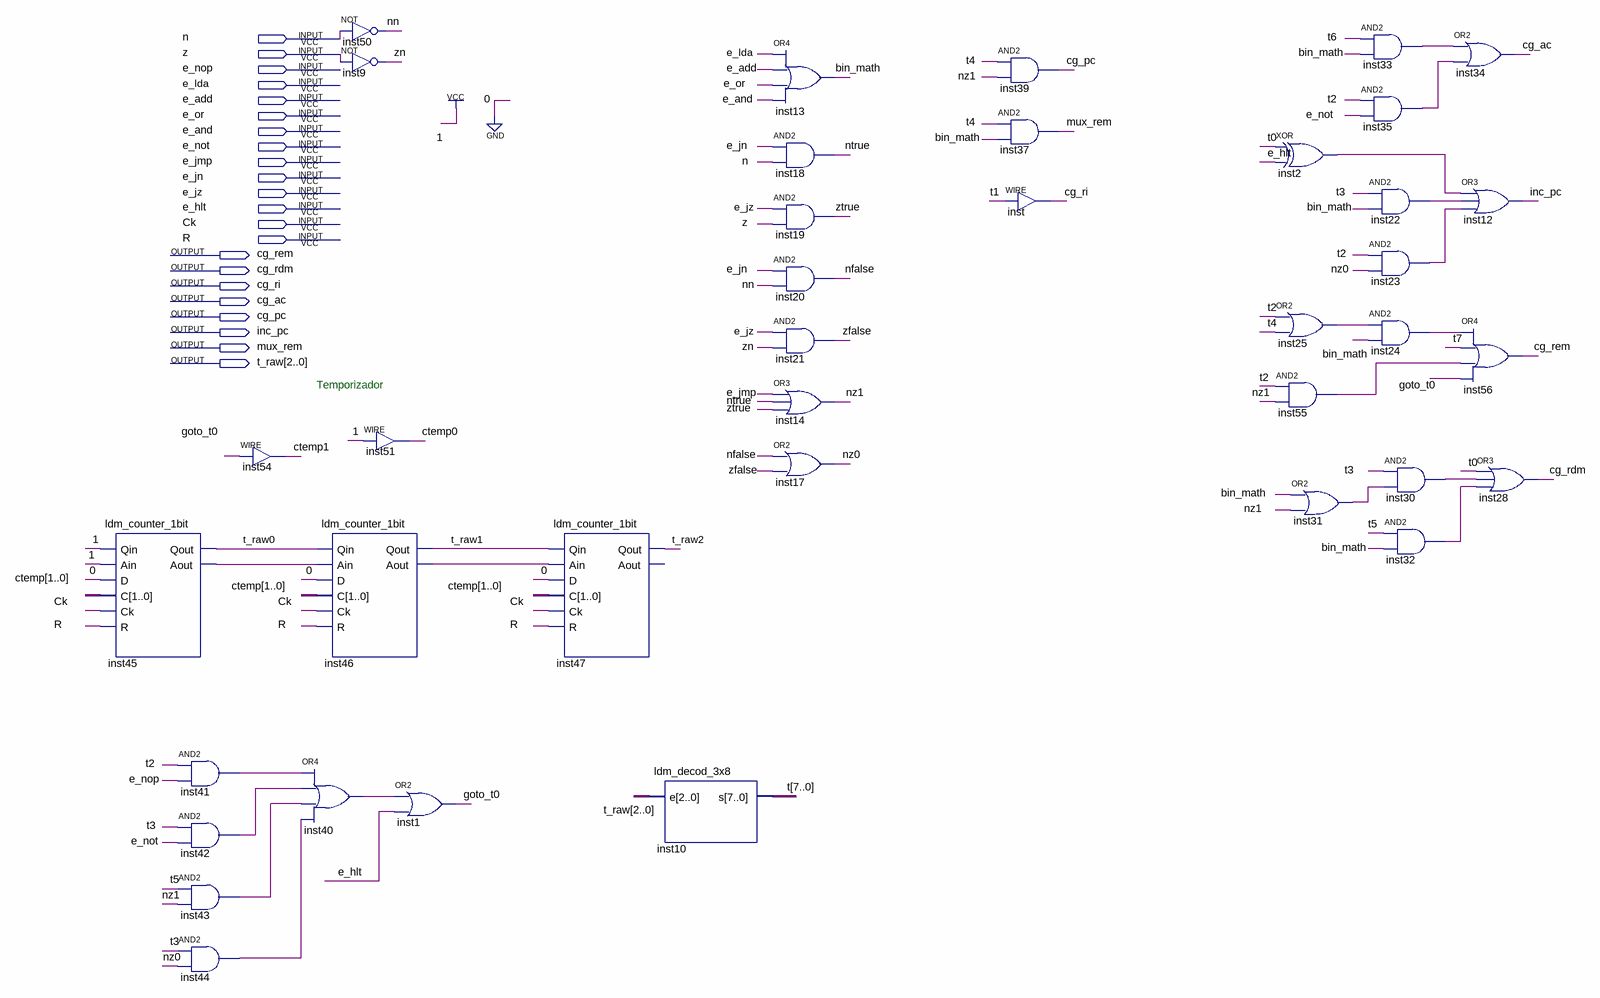
[diagram p0: schematic sheet]
// Quartus schematic ldm_controle_neander.bdf as structural Verilog: 39 symbols, 22 pins
module ldm_controle_neander (
  input  n,
  input  z,
  input  e_nop,
  input  e_lda,
  input  e_add,
  input  e_or,
  input  e_and,
  input  e_not,
  input  e_jmp,
  input  e_jn,
  input  e_jz,
  input  e_hlt,
  input  Ck,
  input  R,
  output cg_rem,
  output cg_rdm,
  output cg_ri,
  output cg_ac,
  output cg_pc,
  output inc_pc,
  output mux_rem,
  output [2:0] t_raw
);

  wire bin_math, goto_t0, inst2_out, inst22_out, inst23_out, inst24_out, inst25_out, inst30_out, inst31_out,
       inst32_out, inst33_out, inst35_out, inst40_out, inst41_out, inst42_out, inst43_out, inst44_out,
       inst45_aout, inst46_aout, inst55_out, nfalse, nn, ntrue, nz0, nz1, zfalse, zn, ztrue;
  wire [1:0] ctemp;
  wire [7:0] t;

  ldm_counter_1bit inst45 (
    .Qin(1'b1), .Ain(1'b1), .D(1'b0), .C(ctemp), .Ck(Ck), .R(R), .Qout(t_raw[0]), .Aout(inst45_aout));
  and inst41 (inst41_out, t[2], e_nop);
  and inst42 (inst42_out, t[3], e_not);
  and inst43 (inst43_out, t[5], nz1);
  and inst44 (inst44_out, t[3], nz0);
  assign ctemp[1] = goto_t0;  // WIRE inst54
  not inst50 (nn, n);
  not inst9 (zn, z);
  ldm_counter_1bit inst46 (
    .Qin(t_raw[0]), .Ain(inst45_aout), .D(1'b0), .C(ctemp), .Ck(Ck), .R(R), .Qout(t_raw[1]),
    .Aout(inst46_aout));
  or inst40 (inst40_out, inst41_out, inst42_out, inst43_out, inst44_out);
  assign ctemp[0] = 1'b1;  // WIRE inst51
  or inst1 (goto_t0, inst40_out, e_hlt);
  ldm_counter_1bit inst47 (
    .Qin(t_raw[1]), .Ain(inst46_aout), .D(1'b0), .C(ctemp), .Ck(Ck), .R(R), .Qout(t_raw[2]));  // open: Aout
  ldm_decod_3x8 inst10 (.e(t_raw), .s(t));
  or inst13 (bin_math, e_lda, e_add, e_or, e_and);
  and inst18 (ntrue, e_jn, n);
  and inst19 (ztrue, e_jz, z);
  and inst20 (nfalse, e_jn, nn);
  and inst21 (zfalse, e_jz, zn);
  or inst14 (nz1, e_jmp, ntrue, ztrue);
  or inst17 (nz0, nfalse, zfalse);
  and inst39 (cg_pc, t[4], nz1);
  and inst37 (mux_rem, t[4], bin_math);
  assign cg_ri = t[1];  // WIRE inst
  xor inst2 (inst2_out, t[0], e_hlt);
  or inst25 (inst25_out, t[2], t[4]);
  and inst55 (inst55_out, t[2], nz1);
  or inst31 (inst31_out, bin_math, nz1);
  and inst33 (inst33_out, t[6], bin_math);
  and inst35 (inst35_out, t[2], e_not);
  and inst22 (inst22_out, t[3], bin_math);
  and inst23 (inst23_out, t[2], nz0);
  and inst24 (inst24_out, inst25_out, bin_math);
  and inst30 (inst30_out, t[3], inst31_out);
  and inst32 (inst32_out, t[5], bin_math);
  or inst34 (cg_ac, inst33_out, inst35_out);
  or inst12 (inc_pc, inst2_out, inst22_out, inst23_out);
  or inst56 (cg_rem, inst24_out, t[7], inst55_out, goto_t0);
  or inst28 (cg_rdm, t[0], inst30_out, inst32_out);

  // Notes on the sheet:
  //   Temporizador
endmodule
